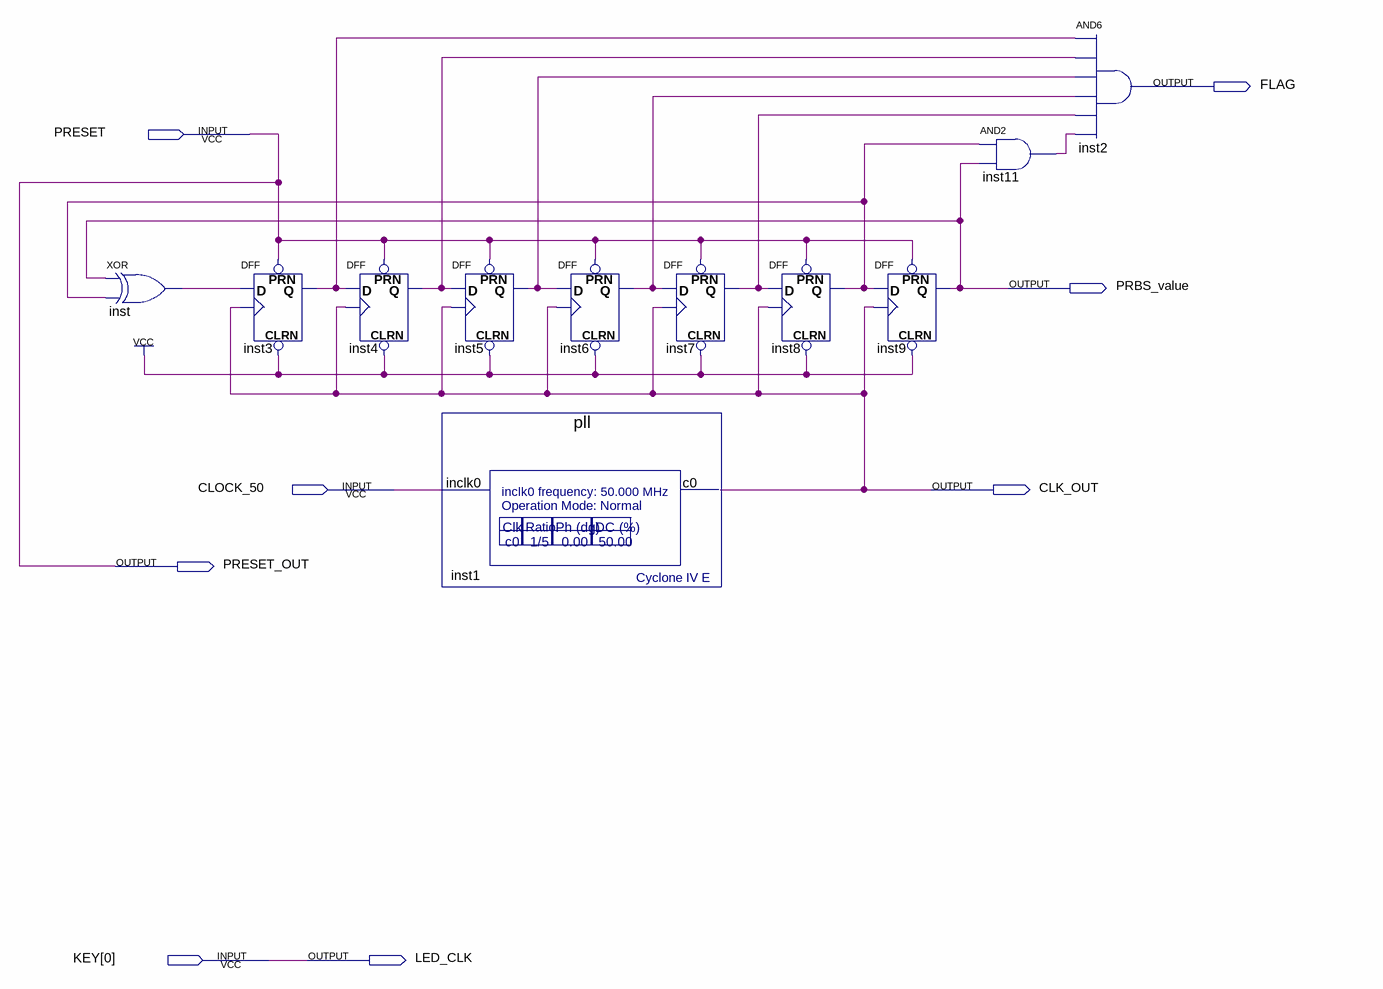
[diagram p0: schematic sheet]
// Quartus schematic BERT.bdf as structural Verilog: 11 symbols, 8 pins
module BERT (
  input  PRESET,
  input  CLOCK_50,
  input  [0:0] KEY,
  output FLAG,
  output PRBS_value,
  output CLK_OUT,
  output PRESET_OUT,
  output LED_CLK
);

  wire inst3_q, inst4_q, inst5_q, inst6_q, inst7_q, inst8_q, inst11_out, inst_out;

  xor inst (inst_out, PRBS_value, inst8_q);
  DFF inst3 (.CLRN(1'b1), .CLK(CLK_OUT), .D(inst_out), .PRN(PRESET), .Q(inst3_q));
  DFF inst4 (.CLRN(1'b1), .CLK(CLK_OUT), .D(inst3_q), .PRN(PRESET), .Q(inst4_q));
  DFF inst5 (.CLRN(1'b1), .CLK(CLK_OUT), .D(inst4_q), .PRN(PRESET), .Q(inst5_q));
  pll inst1 (.inclk0(CLOCK_50), .c0(CLK_OUT));
  DFF inst6 (.CLRN(1'b1), .CLK(CLK_OUT), .D(inst5_q), .PRN(PRESET), .Q(inst6_q));
  DFF inst7 (.CLRN(1'b1), .CLK(CLK_OUT), .D(inst6_q), .PRN(PRESET), .Q(inst7_q));
  DFF inst8 (.CLRN(1'b1), .CLK(CLK_OUT), .D(inst7_q), .PRN(PRESET), .Q(inst8_q));
  DFF inst9 (.CLRN(1'b1), .CLK(CLK_OUT), .D(inst8_q), .PRN(PRESET), .Q(PRBS_value));
  and inst11 (inst11_out, inst8_q, PRBS_value);
  and inst2 (FLAG, inst3_q, inst4_q, inst5_q, inst6_q, inst7_q, inst11_out);

  assign LED_CLK = KEY[0];
  assign PRESET_OUT = PRESET;
endmodule
